# Altium schematic sheet E-22 Blaster Bit.SchDoc: E-22 Blaster Bit
size B; DrawnBy: Jeremie Boulianne; Organization: Synthiam Inc.; Address1: Unit 10, 6120 - 11 St. SE; Address2: Calgary, AB; Address3: T2H 2L7; Address4: Canada
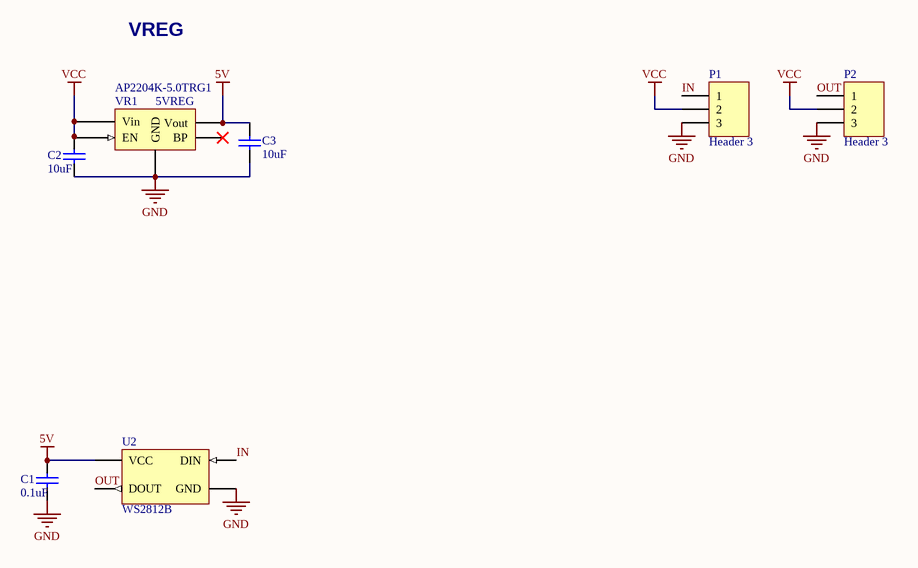
[diagram p0: E-22 Blaster Bit.SchDoc]

## Parts
C1  value 0.1uF  [0805 TIGHT]  (hidden comment: 18pF)
C2  value 10uF  [0805 TIGHT]  (hidden comment: 2.2uF)
C3  value 10uF  [0805 TIGHT]  (hidden comment: 100nF)
P1  Header 3  [JST-PH 3-PIN]
P2  Header 3  [HDR1X3]
U2  WS2812B  [ws2812b]
VR1  5VREG  [SOT-25 New]

## Nets
5V: C1.2 C3.1 U2.1(VCC) VR1.2(Vout)
GND: C1.1 C2.2 C3.2 P1.3 P2.3 U2.3(GND) VR1.3(GND)
VCC: C2.1 P1.2 P2.2 VR1.4(EN) VR1.5(Vin)
IN: P1.1 U2.4(DIN)
OUT: P2.1 U2.2(DOUT)

Not connected (* = marked no-connect by the designer): VR1 1(BP)*

## Notes on the sheet
- VREG
- Labels drawn without touching a wire or pin: AP2204K-5.0TRG1
- Property of:
- Size:
- Date:
- B
- Drawn By:
- Time:
- Revision:
- Copyright © 2019 Synthiam Inc. All rights reserved.

## Library data of the parts
C1-C3 = Cap: Capacitor; Published: 8-Jun-2000; LatestRevisionDate: 17-Jul-2002; LatestRevisionNote: Re-released for DXP Platform.; PackageReference: RAD-0.3; Publisher: Altium Limited
P1 P2 = Header 3: Header, 3-Pin; LatestRevisionDate: 17-Jul-2002; LatestRevisionNote: Re-released for DXP Platform.; Publisher: Altium Limited
VR1 = Vreg SOT25